# EasyEDA schematic SCH_primary recovery n-3 board_2022-10-10.json

## Sheets
1 Sheet_1: TITLE: Sheet_1; REV: 1.0; Date: 2022-09-22; Sheet: 1/1; Drawn By: cmucheru; Company: Your Company
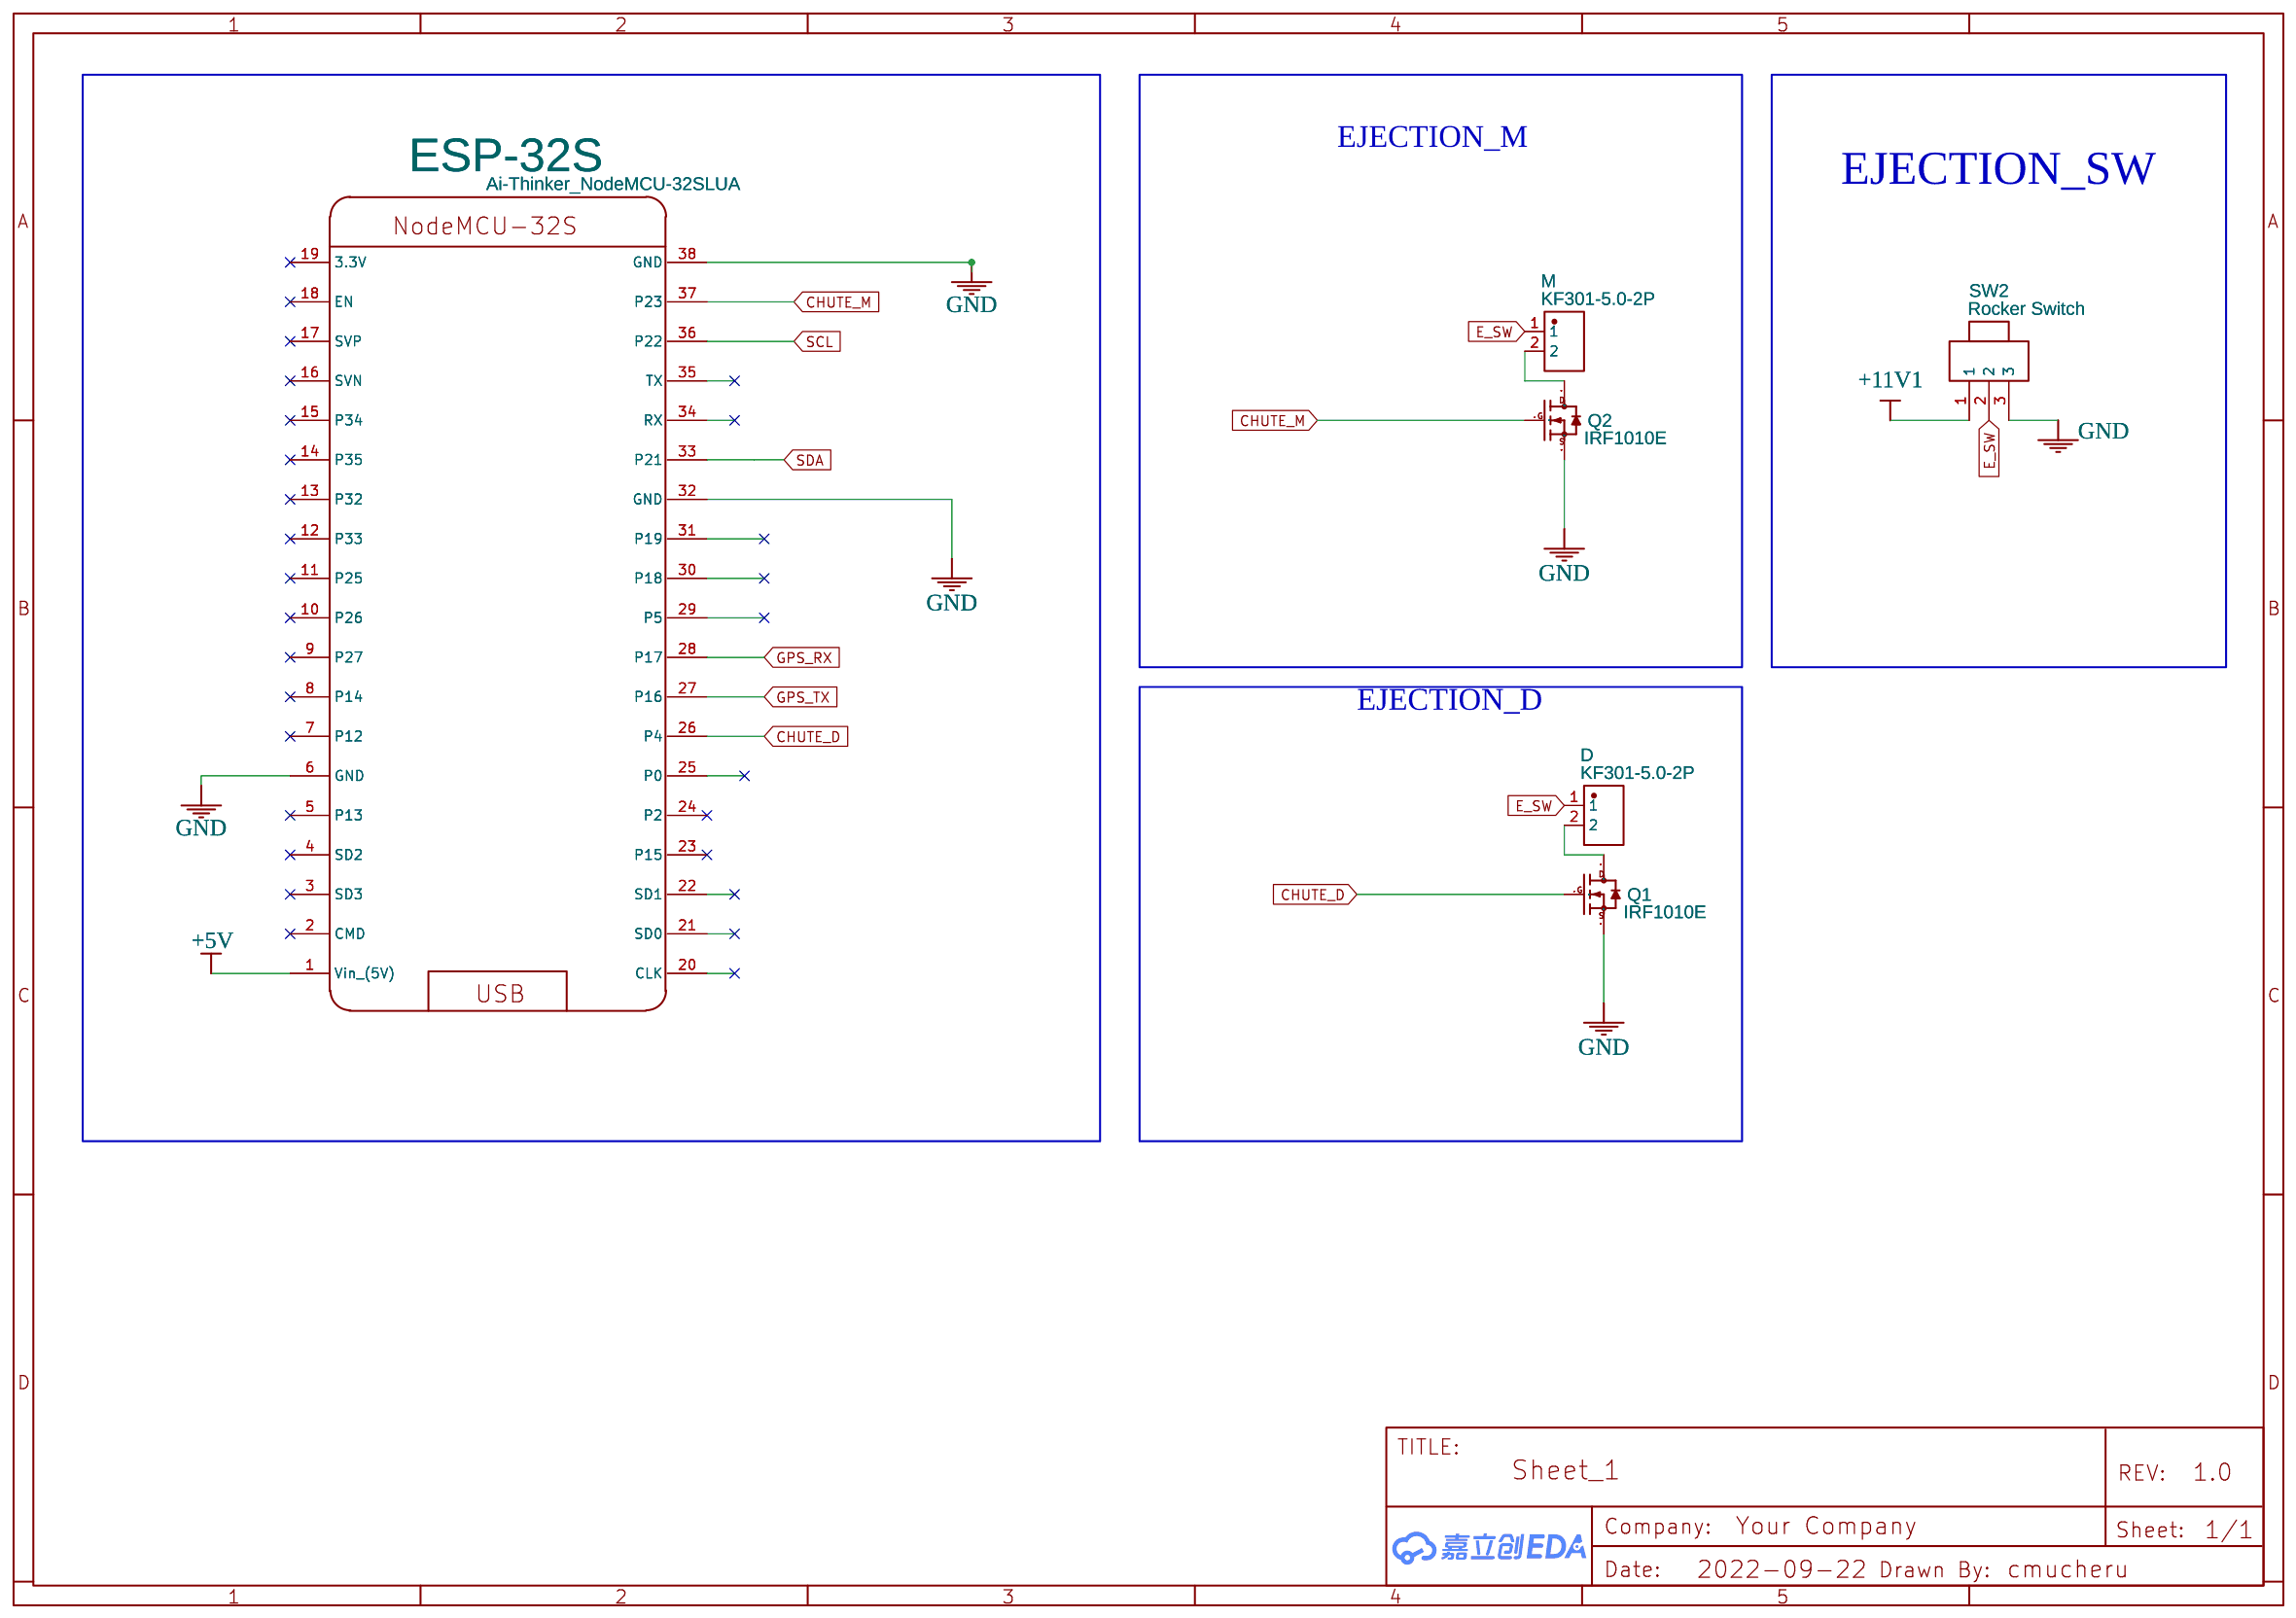
[diagram p0: Sheet_1]
2 Sheet_2: TITLE: Sheet_2
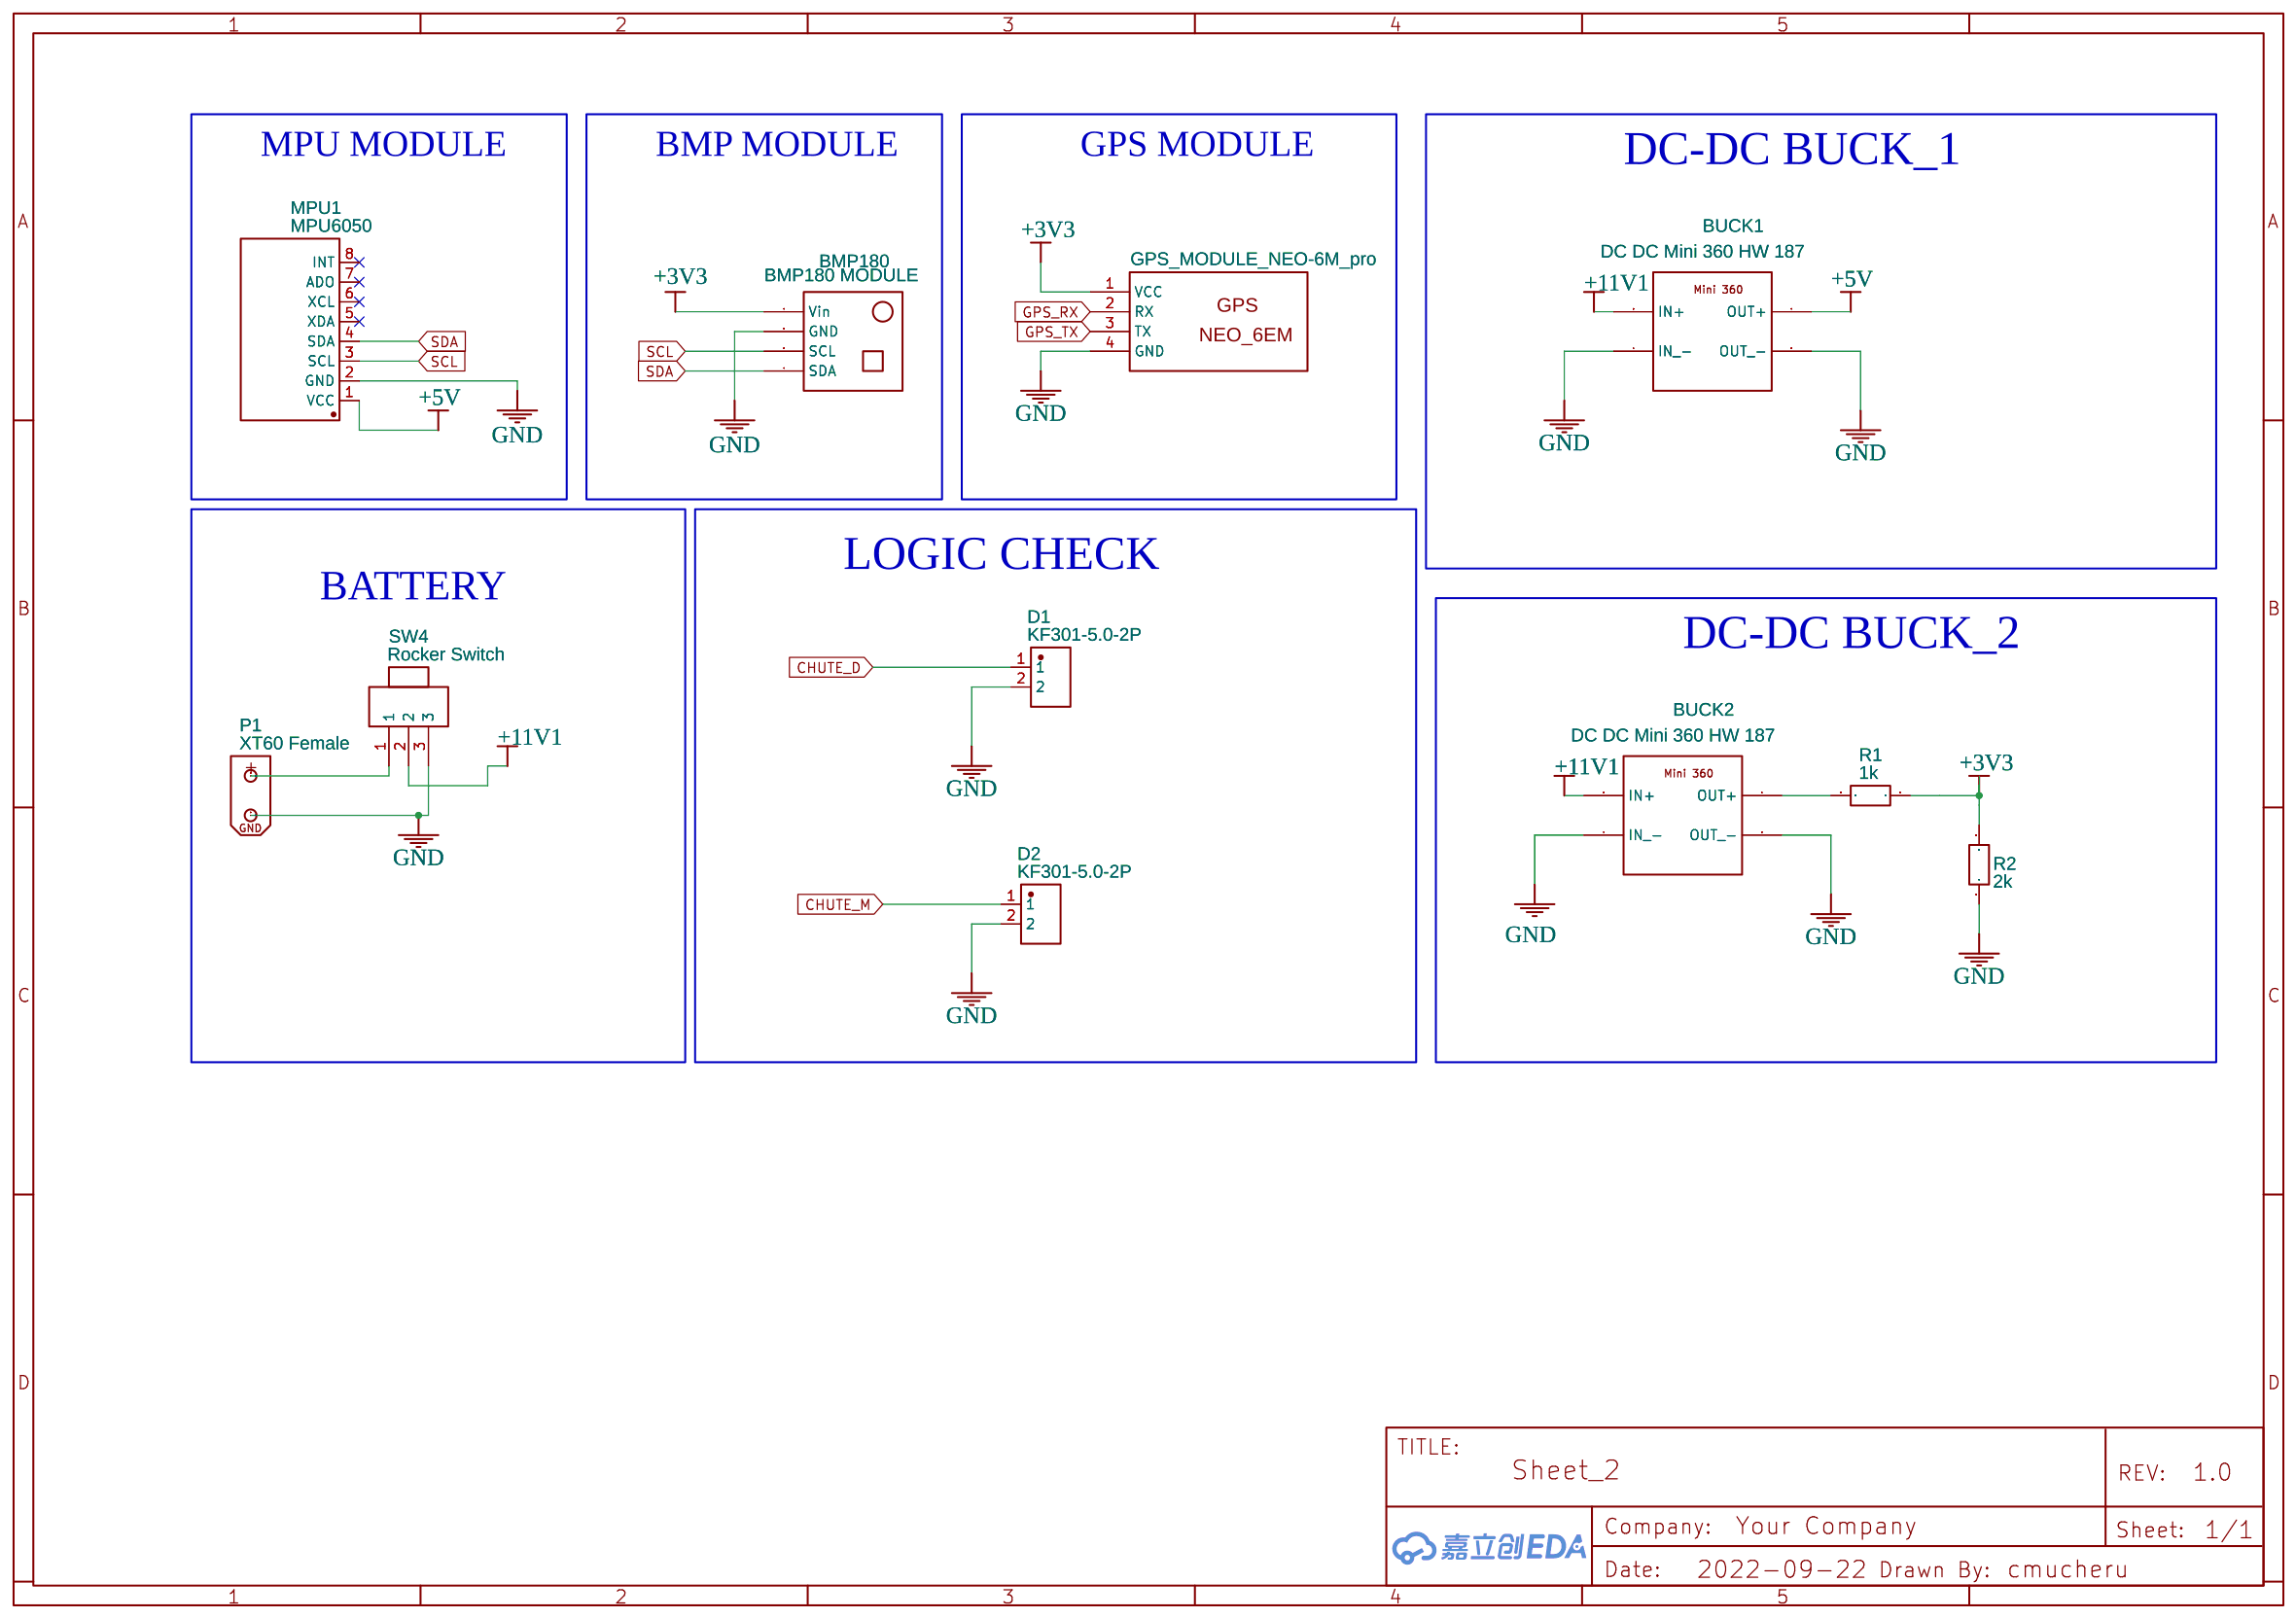
[diagram p1: Sheet_2]

## Parts
sheet Sheet_1
D  KF301-5.0-2P  [CONN-TH_P5.00_KF301-5.0-2P]
ESP-32S  Ai-Thinker_NodeMCU-32SLUA  [AI-THINKER_NODEMCU-32SLUA]
M  KF301-5.0-2P  [CONN-TH_P5.00_KF301-5.0-2P]
Q1  IRF1010E  [DC-MOSFET-TO-220]
Q2  IRF1010E  [DC-MOSFET-TO-220]
SW2  Rocker Switch  [ROCKER SWITCH TH]
sheet Sheet_2
BMP180  BMP180 MODULE  [BMP180 MODULE (HW-596)]
BUCK1  DC DC Mini 360 HW 187  [DC_DC_MINI360]
BUCK2  DC DC Mini 360 HW 187  [DC_DC_MINI360]
D1  KF301-5.0-2P  [CONN-TH_P5.00_KF301-5.0-2P]
D2  KF301-5.0-2P  [CONN-TH_P5.00_KF301-5.0-2P]
GPS_NEO-2EM  GPS_MODULE_NEO-6M_pro  [GPS_MODULE]
MPU1  MPU6050  [MPU6050]
P1  XT60 Female  [XT60-F]
R1  1k  [RES-TH_BD2.5-L7.0-P11.00-D0.6]
R2  2k  [RES-TH_BD2.5-L7.0-P11.00-D0.6]
SW4  Rocker Switch  [ROCKER SWITCH TH]

## Library data of the parts
D D1 D2 M = KF301-5.0-2P: Supplier: LCSC; Supplier Part: C474881; Manufacturer: Cixi Kefa Elec; Contributor: LCSC; JLCPCB Part Class: Extended Part
ESP-32S = Ai-Thinker_NodeMCU-32SLUA: Supplier: LCSC; Supplier Part: C111436; Manufacturer: Ai-Thinker; Manufacturer Part: NodeMCU-32SLua; Contributor: jobsonp checked by LCSC
Q1 Q2 = Mosfet-N: Contributor: dina
SW2 SW4 = Rocker Switch: Mounted: Yes
BMP180 = BMP180 MODULE: Manufacturer Part: BMP180 (HW-596); Contributor: esguti
BUCK1 BUCK2 = DC DC Mini 360 HW 187: Contributor: stanpak; sourceId: FRLFXR8qI
GPS_NEO-2EM = GPS_MODULE_NEO-6M_pro: Contributor: Sanchezz2; sourceId: cy4mEWdvN
MPU1 = MPU6050: Supplier Part: GY521; Contributor: rahulaggarwal
P1 = XT60 Female: Manufacturer: Changzhou Amass Elec; Contributor: rifanoz
R1 R2 = OD684JE: Supplier: LCSC; Supplier Part: C3527706; Manufacturer: Ohmite; link: https://atta.szlcsc.comnull; Resistance: 680kΩ; Contributor: lcsc

## Nets
+3V3: BMP180.1(Vin) GPS_NEO-2EM.1(VCC) R1.1 R2.2
+5V: BUCK1.1(OUT+) ESP-32S.1(Vin (5V)) MPU1.1(VCC)
+11V1: BUCK1.3(IN+) BUCK2.3(IN+) SW2.1 SW4.2
GND: BMP180.2(GND) BUCK1.2(OUT -) BUCK1.4(IN -) BUCK2.2(OUT -) BUCK2.4(IN -) D1.2 D2.2 ESP-32S.6(GND) ESP-32S.32(GND) ESP-32S.38(GND) GPS_NEO-2EM.4(GND) MPU1.2(GND) P1.1 Q1.3(S) Q2.3(S) R2.1 SW2.3 SW4.3
CHUTE_D: D1.1 ESP-32S.26(P4) Q1.1(G)
CHUTE_M: D2.1 ESP-32S.37(P23) Q2.1(G)
E_SW: D.1 M.1 SW2.2
GPS_RX: ESP-32S.28(P17) GPS_NEO-2EM.2(RX)
GPS_TX: ESP-32S.27(P16) GPS_NEO-2EM.3(TX)
SCL: BMP180.3(SCL) ESP-32S.36(P22) MPU1.3(SCL)
SDA: BMP180.4(SDA) ESP-32S.33(P21) MPU1.4(SDA)
Net-(BUCK2-1): BUCK2.1(OUT+) R1.2
Net-(D-2): D.2 Q1.2(D)
Net-(M-2): M.2 Q2.2(D)
Net-(P1-2): P1.2 SW4.1

Not connected (* = marked no-connect by the designer): ESP-32S 2(CMD)* 3(SD3)* 4(SD2)* 5(P13)* 7(P12)* 8(P14)* 9(P27)* 10(P26)* 11(P25)* 12(P33)* 13(P32)* 14(P35)* 15(P34)* 16(SVN)* 17(SVP)* 18(EN)* 19(3.3V)* 20(CLK) 21(SD0) 22(SD1) 23(P15)* 24(P2)* 25(P0) 29(P5) 30(P18) 31(P19) 34(RX) 35(TX); MPU1 5(XDA)* 6(XCL)* 7(ADO)* 8(INT)*

## Notes on the sheets
sheet 1
- EJECTION_M
- EJECTION_SW
- EJECTION_D
sheet 2
- MPU MODULE
- BMP MODULE
- GPS MODULE
- DC-DC BUCK_1
- LOGIC CHECK
- BATTERY
- DC-DC BUCK_2
